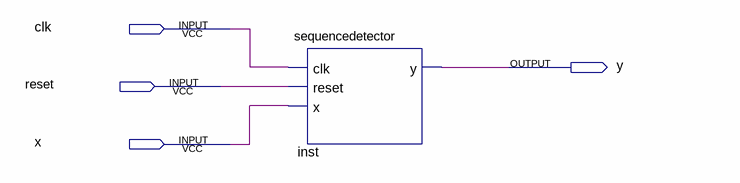
[diagram p0: schematic sheet]
// Quartus schematic MealyFSMSequenceDetector.bdf as structural Verilog: 1 symbols, 4 pins
module MealyFSMSequenceDetector (
  input  clk,
  input  reset,
  input  x,
  output y
);

  sequencedetector inst (.clk(clk), .reset(reset), .x(x), .y(y));
endmodule
